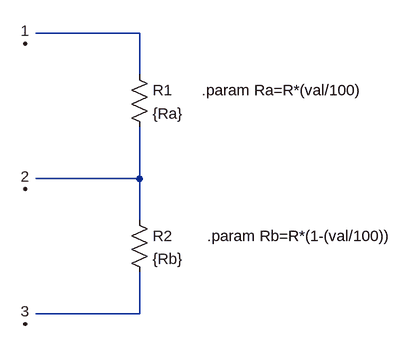
[diagram p0: schematic pot.asc]
pot.asc, the LTspice schematic file:
Version 4
SHEET 1 880 680
WIRE 416 64 256 64
WIRE 416 128 416 64
WIRE 416 288 416 208
WIRE 416 288 256 288
WIRE 416 352 416 288
WIRE 416 496 416 432
WIRE 416 496 256 496
FLAG 240 80 1
FLAG 240 304 2
FLAG 240 512 3
SYMBOL res 400 112 R0
SYMATTR InstName R1
SYMATTR Value {Ra}
SYMBOL res 400 336 R0
SYMATTR InstName R2
SYMATTR Value {Rb}
TEXT 512 152 Left 2 !.param Ra=R*(val/100)
TEXT 520 376 Left 2 !.param Rb=R*(1-(val/100))

The netlist it stands for:
* pot.asc
R1 N001 N002 {Ra}
R2 N002 N003 {Rb}
.param Ra=R*(val/100)
.param Rb=R*(1-(val/100))
.backanno
.end